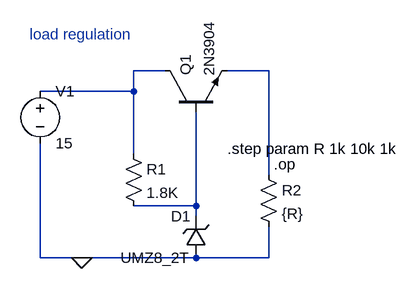
[diagram p0: schematic handdrawn_series_regulator.asc]
handdrawn_series_regulator.asc, the LTspice schematic file:
Version 4.1
SHEET 1 880 680
WIRE 144 144 96 144
WIRE 304 144 240 144
WIRE 96 176 96 144
WIRE 96 176 -48 176
WIRE 96 272 96 176
WIRE 304 304 304 144
WIRE 192 352 192 208
WIRE 192 352 96 352
WIRE 192 368 192 352
WIRE -48 432 -48 256
WIRE 16 432 -48 432
WIRE 192 432 16 432
WIRE 304 432 304 384
WIRE 304 432 192 432
FLAG 16 432 0
SYMBOL npn 144 208 R270
SYMATTR InstName Q1
SYMATTR Value 2N3904
SYMBOL voltage -48 160 R0
WINDOW 123 0 0 Left 0
WINDOW 39 0 0 Left 0
SYMATTR InstName V1
SYMATTR Value 15
SYMBOL res 80 256 R0
SYMATTR InstName R1
SYMATTR Value 1.8K
SYMBOL res 288 288 R0
SYMATTR InstName R2
SYMATTR Value {R}
SYMBOL zener 208 432 R180
WINDOW 0 24 64 Left 2
WINDOW 3 24 0 Left 2
SYMATTR InstName D1
SYMATTR Value UMZ8_2T
TEXT 240 264 Left 2 !.step param R 1k 10k 1k
TEXT 312 288 Left 2 !.op
TEXT -64 88 Left 2 ;load regulation

The netlist it stands for:
* handdrawn_series_regulator.asc
Q1 N001 N003 N002 0 2N3904
V1 N001 0 15
R1 N001 N003 1.8K
R2 N002 0 {R}
D1 0 N003 UMZ8_2T
.model D D
.lib standard.dio
.model NPN NPN
.model PNP PNP
.lib standard.bjt
.step param R 1k 10k 1k
.op
* load regulation
.backanno
.end